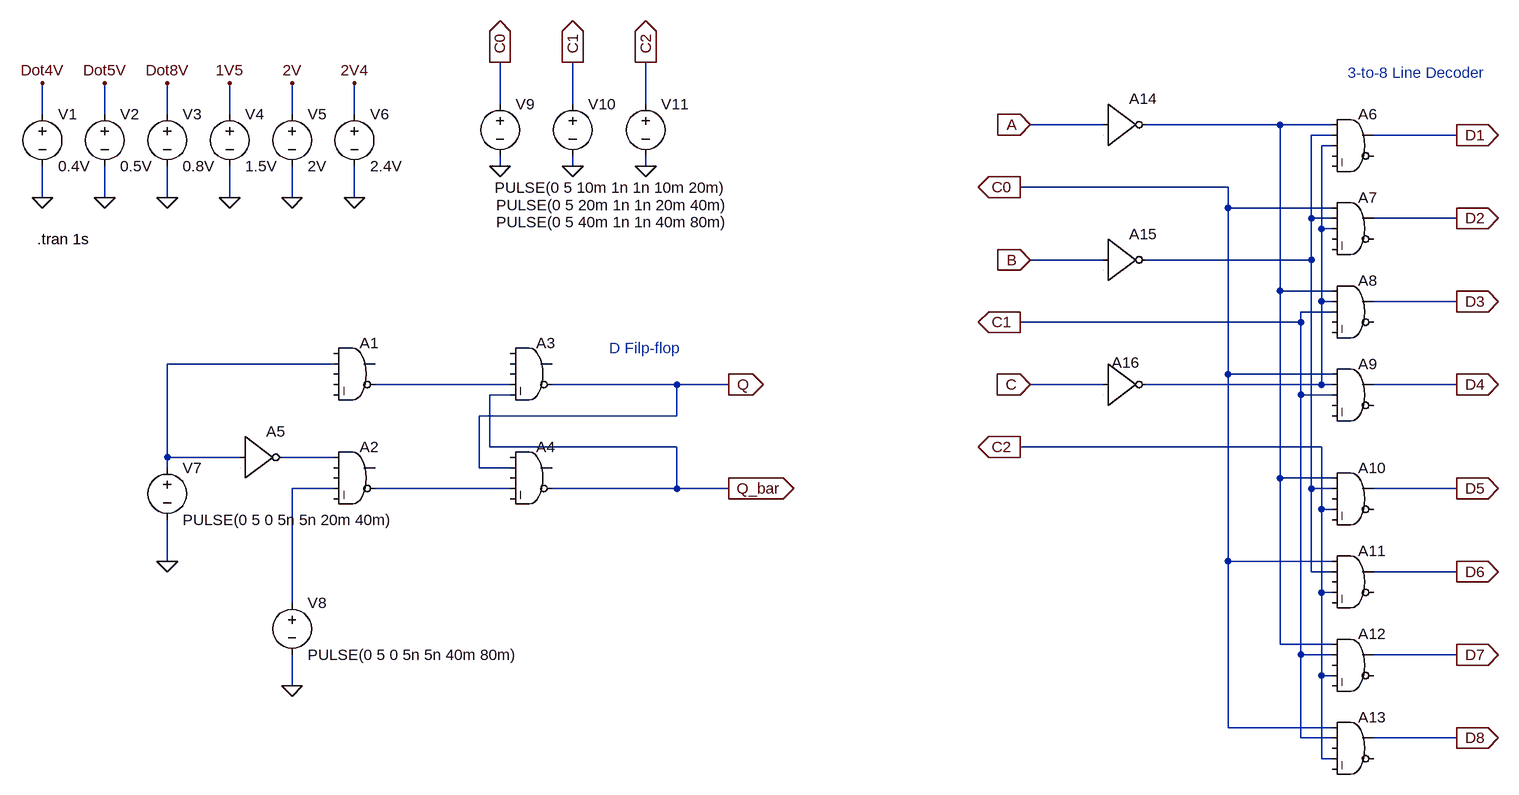
[diagram p0: schematic Components.asc]
Components.asc, the LTspice schematic file:
Version 4
SHEET 1 2380 1128
WIRE 816 64 816 0
WIRE 928 64 928 0
WIRE 1040 64 1040 0
WIRE 112 80 112 32
WIRE 208 80 208 32
WIRE 304 80 304 32
WIRE 400 80 400 32
WIRE 496 80 496 32
WIRE 592 80 592 32
WIRE 1744 96 1632 96
WIRE 2016 96 1808 96
WIRE 2096 96 2016 96
WIRE 2096 112 2064 112
WIRE 2288 112 2160 112
WIRE 2096 128 2080 128
WIRE 816 160 816 144
WIRE 928 160 928 144
WIRE 1040 160 1040 144
WIRE 1936 192 1616 192
WIRE 112 208 112 160
WIRE 208 208 208 160
WIRE 304 208 304 160
WIRE 400 208 400 160
WIRE 496 208 496 160
WIRE 592 208 592 160
WIRE 1936 224 1936 192
WIRE 2096 224 1936 224
WIRE 2064 240 2064 112
WIRE 2096 240 2064 240
WIRE 2288 240 2160 240
WIRE 2080 256 2080 128
WIRE 2096 256 2080 256
WIRE 1744 304 1632 304
WIRE 2064 304 2064 240
WIRE 2064 304 1808 304
WIRE 2016 352 2016 96
WIRE 2096 352 2016 352
WIRE 2080 368 2080 256
WIRE 2096 368 2080 368
WIRE 2288 368 2160 368
WIRE 2096 384 2048 384
WIRE 2048 400 2048 384
WIRE 2048 400 1616 400
WIRE 560 464 304 464
WIRE 1936 480 1936 224
WIRE 2096 480 1936 480
WIRE 832 496 624 496
WIRE 1088 496 896 496
WIRE 1168 496 1088 496
WIRE 1744 496 1632 496
WIRE 2080 496 2080 368
WIRE 2080 496 1808 496
WIRE 2096 496 2080 496
WIRE 2288 496 2160 496
WIRE 832 512 800 512
WIRE 2048 512 2048 400
WIRE 2096 512 2048 512
WIRE 1088 544 1088 496
WIRE 1088 544 784 544
WIRE 800 592 800 512
WIRE 1088 592 800 592
WIRE 2080 592 1616 592
WIRE 304 608 304 464
WIRE 416 608 304 608
WIRE 560 608 480 608
WIRE 304 624 304 608
WIRE 784 624 784 544
WIRE 832 624 784 624
WIRE 2016 640 2016 352
WIRE 2096 640 2016 640
WIRE 560 656 496 656
WIRE 832 656 624 656
WIRE 1088 656 1088 592
WIRE 1088 656 896 656
WIRE 1168 656 1088 656
WIRE 2064 656 2064 304
WIRE 2096 656 2064 656
WIRE 2288 656 2160 656
WIRE 2080 688 2080 592
WIRE 2096 688 2080 688
WIRE 304 768 304 704
WIRE 1936 768 1936 480
WIRE 2096 768 1936 768
WIRE 2064 784 2064 656
WIRE 2096 784 2064 784
WIRE 2288 784 2160 784
WIRE 2080 816 2080 688
WIRE 2096 816 2080 816
WIRE 496 832 496 656
WIRE 2016 896 2016 640
WIRE 2096 896 2016 896
WIRE 2048 912 2048 512
WIRE 2096 912 2048 912
WIRE 2288 912 2160 912
WIRE 2080 944 2080 816
WIRE 2096 944 2080 944
WIRE 496 960 496 912
WIRE 1936 1024 1936 768
WIRE 2096 1024 1936 1024
WIRE 2048 1040 2048 912
WIRE 2096 1040 2048 1040
WIRE 2288 1040 2160 1040
WIRE 2080 1072 2080 944
WIRE 2096 1072 2080 1072
FLAG 112 208 0
FLAG 208 208 0
FLAG 304 208 0
FLAG 400 208 0
FLAG 496 208 0
FLAG 592 208 0
FLAG 112 32 Dot4V
FLAG 208 32 Dot5V
FLAG 304 32 Dot8V
FLAG 400 32 1V5
FLAG 496 32 2V
FLAG 592 32 2V4
FLAG 1168 496 Q
IOPIN 1168 496 Out
FLAG 1168 656 Q_bar
IOPIN 1168 656 Out
FLAG 304 768 0
FLAG 496 960 0
FLAG 816 160 0
FLAG 928 160 0
FLAG 1040 160 0
FLAG 816 0 C0
IOPIN 816 0 Out
FLAG 928 0 C1
IOPIN 928 0 Out
FLAG 1040 0 C2
IOPIN 1040 0 Out
FLAG 2288 112 D1
IOPIN 2288 112 Out
FLAG 2288 240 D2
IOPIN 2288 240 Out
FLAG 2288 368 D3
IOPIN 2288 368 Out
FLAG 2288 496 D4
IOPIN 2288 496 Out
FLAG 2288 656 D5
IOPIN 2288 656 Out
FLAG 2288 784 D6
IOPIN 2288 784 Out
FLAG 2288 912 D7
IOPIN 2288 912 Out
FLAG 2288 1040 D8
IOPIN 2288 1040 Out
FLAG 1632 96 A
IOPIN 1632 96 In
FLAG 1632 304 B
IOPIN 1632 304 In
FLAG 1632 496 C
IOPIN 1632 496 In
FLAG 1616 192 C0
IOPIN 1616 192 Out
FLAG 1616 400 C1
IOPIN 1616 400 Out
FLAG 1616 592 C2
IOPIN 1616 592 Out
SYMBOL voltage 112 64 R0
SYMATTR InstName V1
SYMATTR Value 0.4V
SYMBOL voltage 208 64 R0
SYMATTR InstName V2
SYMATTR Value 0.5V
SYMBOL voltage 304 64 R0
SYMATTR InstName V3
SYMATTR Value 0.8V
SYMBOL voltage 400 64 R0
SYMATTR InstName V4
SYMATTR Value 1.5V
SYMBOL voltage 496 64 R0
SYMATTR InstName V5
SYMATTR Value 2V
SYMBOL voltage 592 64 R0
SYMATTR InstName V6
SYMATTR Value 2.4V
SYMBOL Digital\\and 592 416 R0
SYMATTR InstName A1
SYMBOL Digital\\and 592 576 R0
SYMATTR InstName A2
SYMBOL Digital\\and 864 416 R0
SYMATTR InstName A3
SYMBOL Digital\\and 864 576 R0
SYMATTR InstName A4
SYMBOL voltage 304 608 R0
WINDOW 123 0 0 Left 0
WINDOW 39 0 0 Left 0
SYMATTR InstName V7
SYMATTR Value PULSE(0 5 0 5n 5n 20m 40m)
SYMBOL voltage 496 816 R0
WINDOW 123 0 0 Left 0
WINDOW 39 0 0 Left 0
SYMATTR InstName V8
SYMATTR Value PULSE(0 5 0 5n 5n 40m 80m)
SYMBOL Digital\\inv 416 544 R0
SYMATTR InstName A5
SYMBOL voltage 816 48 R0
WINDOW 3 -8 145 Left 2
WINDOW 123 0 0 Left 0
WINDOW 39 0 0 Left 0
SYMATTR InstName V9
SYMATTR Value PULSE(0 5 10m 1n 1n 10m 20m)
SYMBOL voltage 928 48 R0
WINDOW 3 -118 172 Left 2
WINDOW 123 0 0 Left 0
WINDOW 39 0 0 Left 0
SYMATTR InstName V10
SYMATTR Value PULSE(0 5 20m 1n 1n 20m 40m)
SYMBOL voltage 1040 48 R0
WINDOW 3 -230 198 Left 2
WINDOW 123 0 0 Left 0
WINDOW 39 0 0 Left 0
SYMATTR InstName V11
SYMATTR Value PULSE(0 5 40m 1n 1n 40m 80m)
SYMBOL Digital\\and 2128 64 R0
SYMATTR InstName A6
SYMBOL Digital\\and 2128 192 R0
SYMATTR InstName A7
SYMBOL Digital\\and 2128 320 R0
SYMATTR InstName A8
SYMBOL Digital\\and 2128 448 R0
SYMATTR InstName A9
SYMBOL Digital\\and 2128 608 R0
SYMATTR InstName A10
SYMBOL Digital\\and 2128 736 R0
SYMATTR InstName A11
SYMBOL Digital\\and 2128 864 R0
SYMATTR InstName A12
SYMBOL Digital\\and 2128 992 R0
SYMATTR InstName A13
SYMBOL Digital\\inv 1744 32 R0
SYMATTR InstName A14
SYMBOL Digital\\inv 1744 240 R0
SYMATTR InstName A15
SYMBOL Digital\\inv 1744 432 R0
WINDOW 0 13 30 Left 2
SYMATTR InstName A16
TEXT 104 272 Left 2 !.tran 1s
TEXT 984 440 Left 2 ;D Filp-flop
TEXT 2120 16 Left 2 ;3-to-8 Line Decoder

The netlist it stands for:
* Components.asc
V1 Dot4V 0 0.4V
V2 Dot5V 0 0.5V
V3 Dot8V 0 0.8V
V4 1V5 0 1.5V
V5 2V 0 2V
V6 2V4 0 2.4V
A1 0 N004 0 0 0 N005 0 0 AND
A2 N006 0 0 N007 0 N008 0 0 AND
A3 0 0 0 N005 Q_bar Q 0 0 AND
A4 0 Q 0 N008 0 Q_bar 0 0 AND
V7 N004 0 PULSE(0 5 0 5n 5n 20m 40m)
V8 N007 0 PULSE(0 5 0 5n 5n 40m 80m)
A5 N004 0 0 0 0 N006 0 0 BUF
V9 C0 0 PULSE(0 5 10m 1n 1n 10m 20m)
V10 C1 0 PULSE(0 5 20m 1n 1n 20m 40m)
V11 C2 0 PULSE(0 5 40m 1n 1n 40m 80m)
A6 N001 N002 N003 0 0 0 D1 0 AND
A7 C0 N002 N003 0 0 0 D2 0 AND
A8 N001 N003 C1 0 0 0 D3 0 AND
A9 C0 N003 C1 0 0 0 D4 0 AND
A10 N001 N002 0 C2 0 0 D5 0 AND
A11 C0 N002 0 C2 0 0 D6 0 AND
A12 N001 C1 0 C2 0 0 D7 0 AND
A13 C0 C1 0 C2 0 0 D8 0 AND
A14 A 0 0 0 0 N001 0 0 BUF
A15 B 0 0 0 0 N002 0 0 BUF
A16 C 0 0 0 0 N003 0 0 BUF
.tran 1s
* D Filp-flop
* 3-to-8 Line Decoder
.backanno
.end